# EAGLE schematic power (EAGLE 9.6.2)

## Sheet 1 of 2
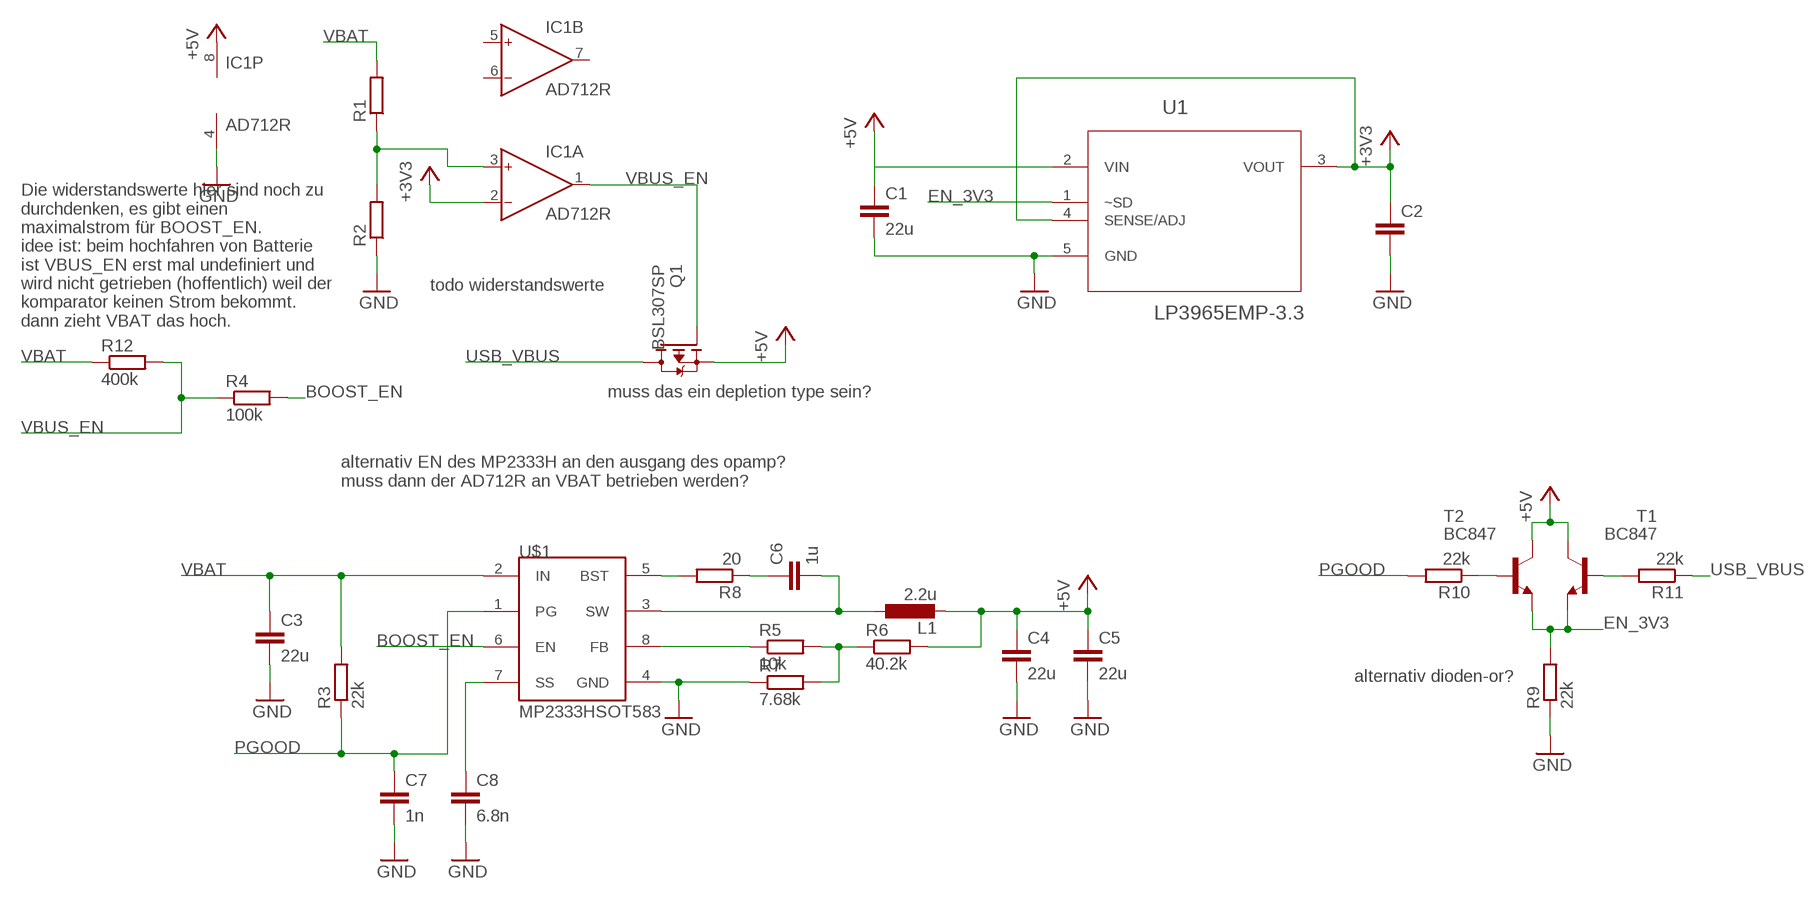
[diagram p0: schematic, sheet 1]

### Parts
C1  22u  C-EUC0603  [C0603]
C2  C-EUC0603  [C0603]
C3  22u  C-EUC0805  [C0805]
C4  22u  C-EUC0805  [C0805]
C5  22u  C-EUC0805  [C0805]
C6  1u  C-EUC0805  [C0805]
C7  1n  C-EUC0603  [C0603]
C8  6.8n  C-EUC0603  [C0603]
IC1  AD712R  [SO8]
L1  2.2u  L-EUPIS2816  [PIS2816]
Q1  BSL307SP  [SC74_INFINEON]
R1  R-EU_R0603  [R0603]
R2  R-EU_R0603  [R0603]
R3  22k  R-EU_R0603  [R0603]
R4  100k  R-EU_R0603  [R0603]
R5  10k  R-EU_R0603  [R0603]
R6  40.2k  R-EU_R0603  [R0603]
R7  7.68k  R-EU_R0603  [R0603]
R8  20  R-EU_R0603  [R0603]
R9  22k  R-EU_R0603  [R0603]
R10  22k  R-EU_R0603  [R0603]
R11  22k  R-EU_R0603  [R0603]
R12  400k  R-EU_R0603  [R0603]
T1  BC847  [SOT23]
T2  BC847  [SOT23]
U1  LP3965EMP-3.3  [SOT150P696X180-5N]
U$1  MP2333HSOT583  [SOTFL50P175X60-8N]

### Nets
+3V3: C2.1 IC1.2(A:IN-) U1.3(VOUT) U1.4(SENSE/ADJ)
+5V: C1.1 C4.1 C5.1 IC1.8(P:V+) L1.2 Q1.4(S) R6.2 T1.3(C) T2.3(C) U1.2(VIN)
BOOST_EN: R4.2 U$1.6(EN)
EN_3V3: R9.2 T1.2(E) T2.2(E) U1.1(~SD)
GND: C1.2 C2.2 C3.2 C4.2 C5.2 C7.2 C8.2 IC1.4(P:V-) R2.1 R7.1 R9.1 U1.5(GND) U$1.4(GND)
N$2: IC1.3(A:IN+) R1.1 R2.2
N$5: C6.2 L1.1 U$1.3(SW)
N$7: R5.2 R6.1 R7.2
N$8: R5.1 U$1.8(FB)
N$9: R8.2 U$1.5(BST)
N$10: C6.1 R8.1
N$11: C8.1 U$1.7(SS)
N$12: R10.1 T2.1(B)
N$13: R11.2 T1.1(B)
PGOOD: C7.1 R3.1 R10.2 U$1.1(PG)
USB_VBUS: Q1.1(D) Q1.2(D) Q1.5(D) Q1.6(D) R11.1
VBAT: C3.1 R1.2 R3.2 R12.1 U$1.2(IN)
VBUS_EN: IC1.1(A:OUT) Q1.3(G) R4.1 R12.2
Unconnected: IC1.5(B:IN+) IC1.6(B:IN-) IC1.7(B:OUT)

### Notes on the sheet
- todo widerstandswerte
- Die widerstandswerte hier sind noch zu
  durchdenken, es gibt einen
  maximalstrom für BOOST_EN.
  idee ist: beim hochfahren von Batterie
  ist VBUS_EN erst mal undefiniert und
  wird nicht getrieben (hoffentlich) weil der 
  komparator keinen Strom bekommt.
  dann zieht VBAT das hoch.
- muss das ein depletion type sein?
- alternativ EN des MP2333H an den ausgang des opamp?
  muss dann der AD712R an VBAT betrieben werden?
- alternativ dioden-or?

## Sheet 2 of 2

## Library data of the parts
C1-C8 = rcl:C-EU: CAPACITOR, European symbol; SPICEPREFIX: C
IC1 = analog-devices:AD712: Dual Precision, Low Cost, High Speed BiFET Op Amp Source: http://www.analog.com/static/imported-files/data_sheets/AD712.pdf; MF: ALTERA CORPORATION; MPN: AD712KRZ; OC_FARNELL: 1263975; OC_NEWARK: 59K4556
L1 = rcl:L-EU: INDUCTOR, European symbol; SPICEPREFIX: L
Q1 = transistor-fet:BSL307SP: OptiMOS(R)-P Small-Signal-Transistor P-Channel, Enhancement mode, Logic Level ID -5.5 A Source: http://www.infineon.com/upload/Document/BSL307SP_Rev%201.2.pdf
R1-R12 = rcl:R-EU_: RESISTOR, European symbol; SPICEPREFIX: R
T1 T2 = transistor:BC847: NPN TRANSISTOR
U1 = LP3965EMP-3.3:LP3965EMP-3.3: Fast Ultra Low Dropout Linear Regulators Check availability <https://pricing.snapeda.com/parts/LP3965EMP-3.3/NOPB/Texas%20Instruments/view-part?ref=eda>; AVAILABILITY: In Stock; DESCRIPTION: 1.5-A, low-dropout voltage regulator with sense & enable 5-SOT-223 -40 to 125; MF: Texas Instruments; MP: LP3965EMP-3.3/NOPB; PACKAGE: SOT-223-5 Texas Instruments; PRICE: None; PURCHASE-URL: https://pricing.snapeda.com/search/part/LP3965EMP-3.3/NOPB/?ref=eda
U$1 = MP2333H:MP2333H: MP2333H 4.2 - 18V Input, 3A, 1.2MHz Synchronous Buck Converter with Power Good and Soft Start in SOT583 (1.6x2mm) Package Mouser: 946-MP2333HGTL-P